# EAGLE design BEP2_rev1_RPM_mono (EAGLE 6.4)
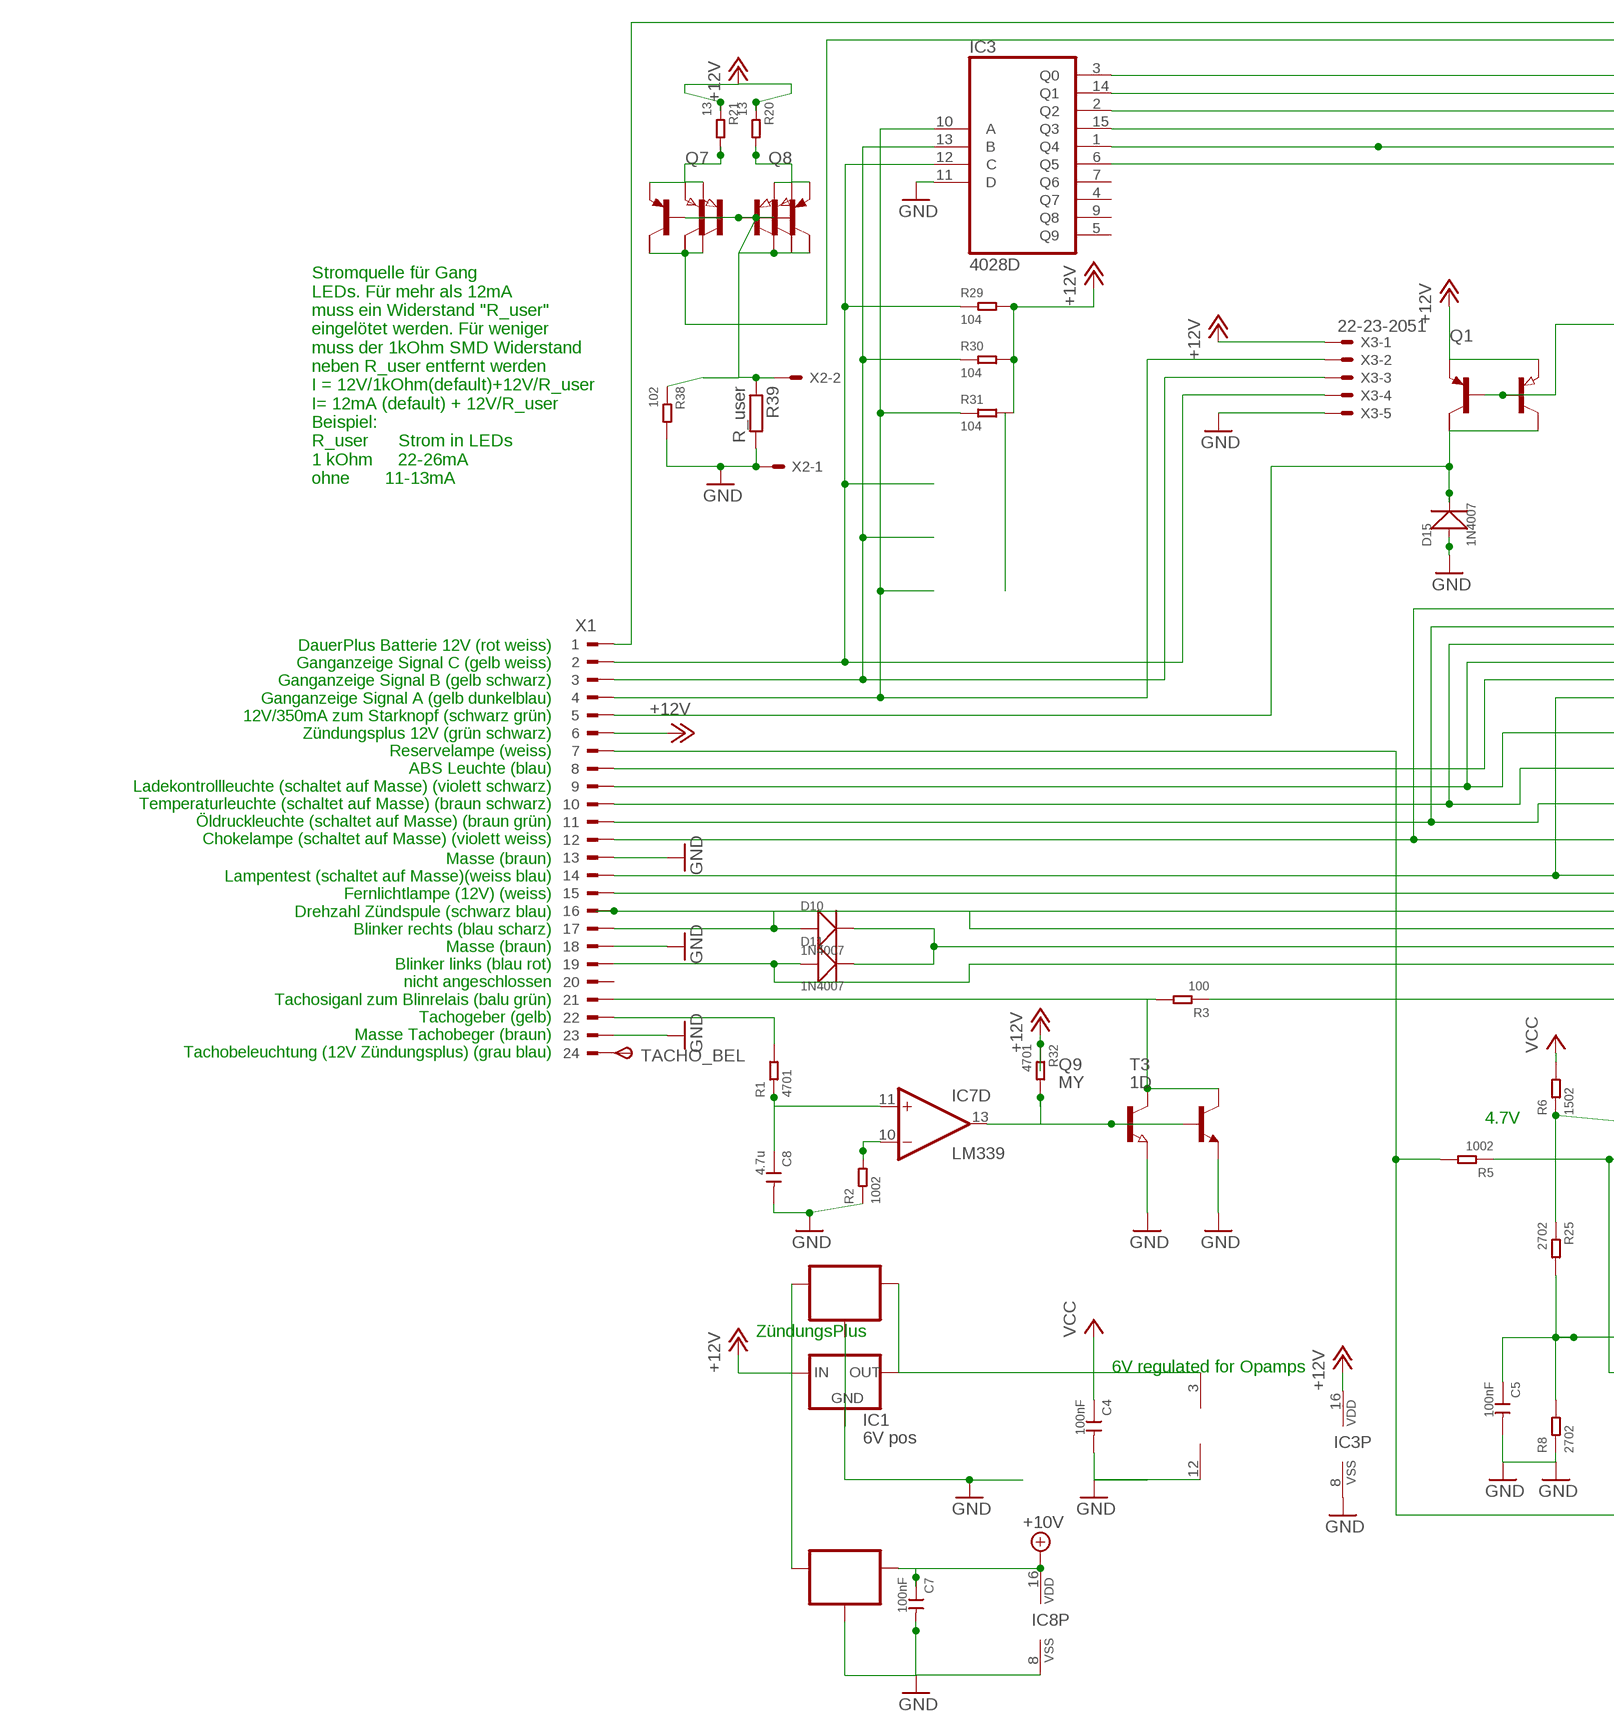
[diagram p0: schematic, sheet 1, part 1 of 2]
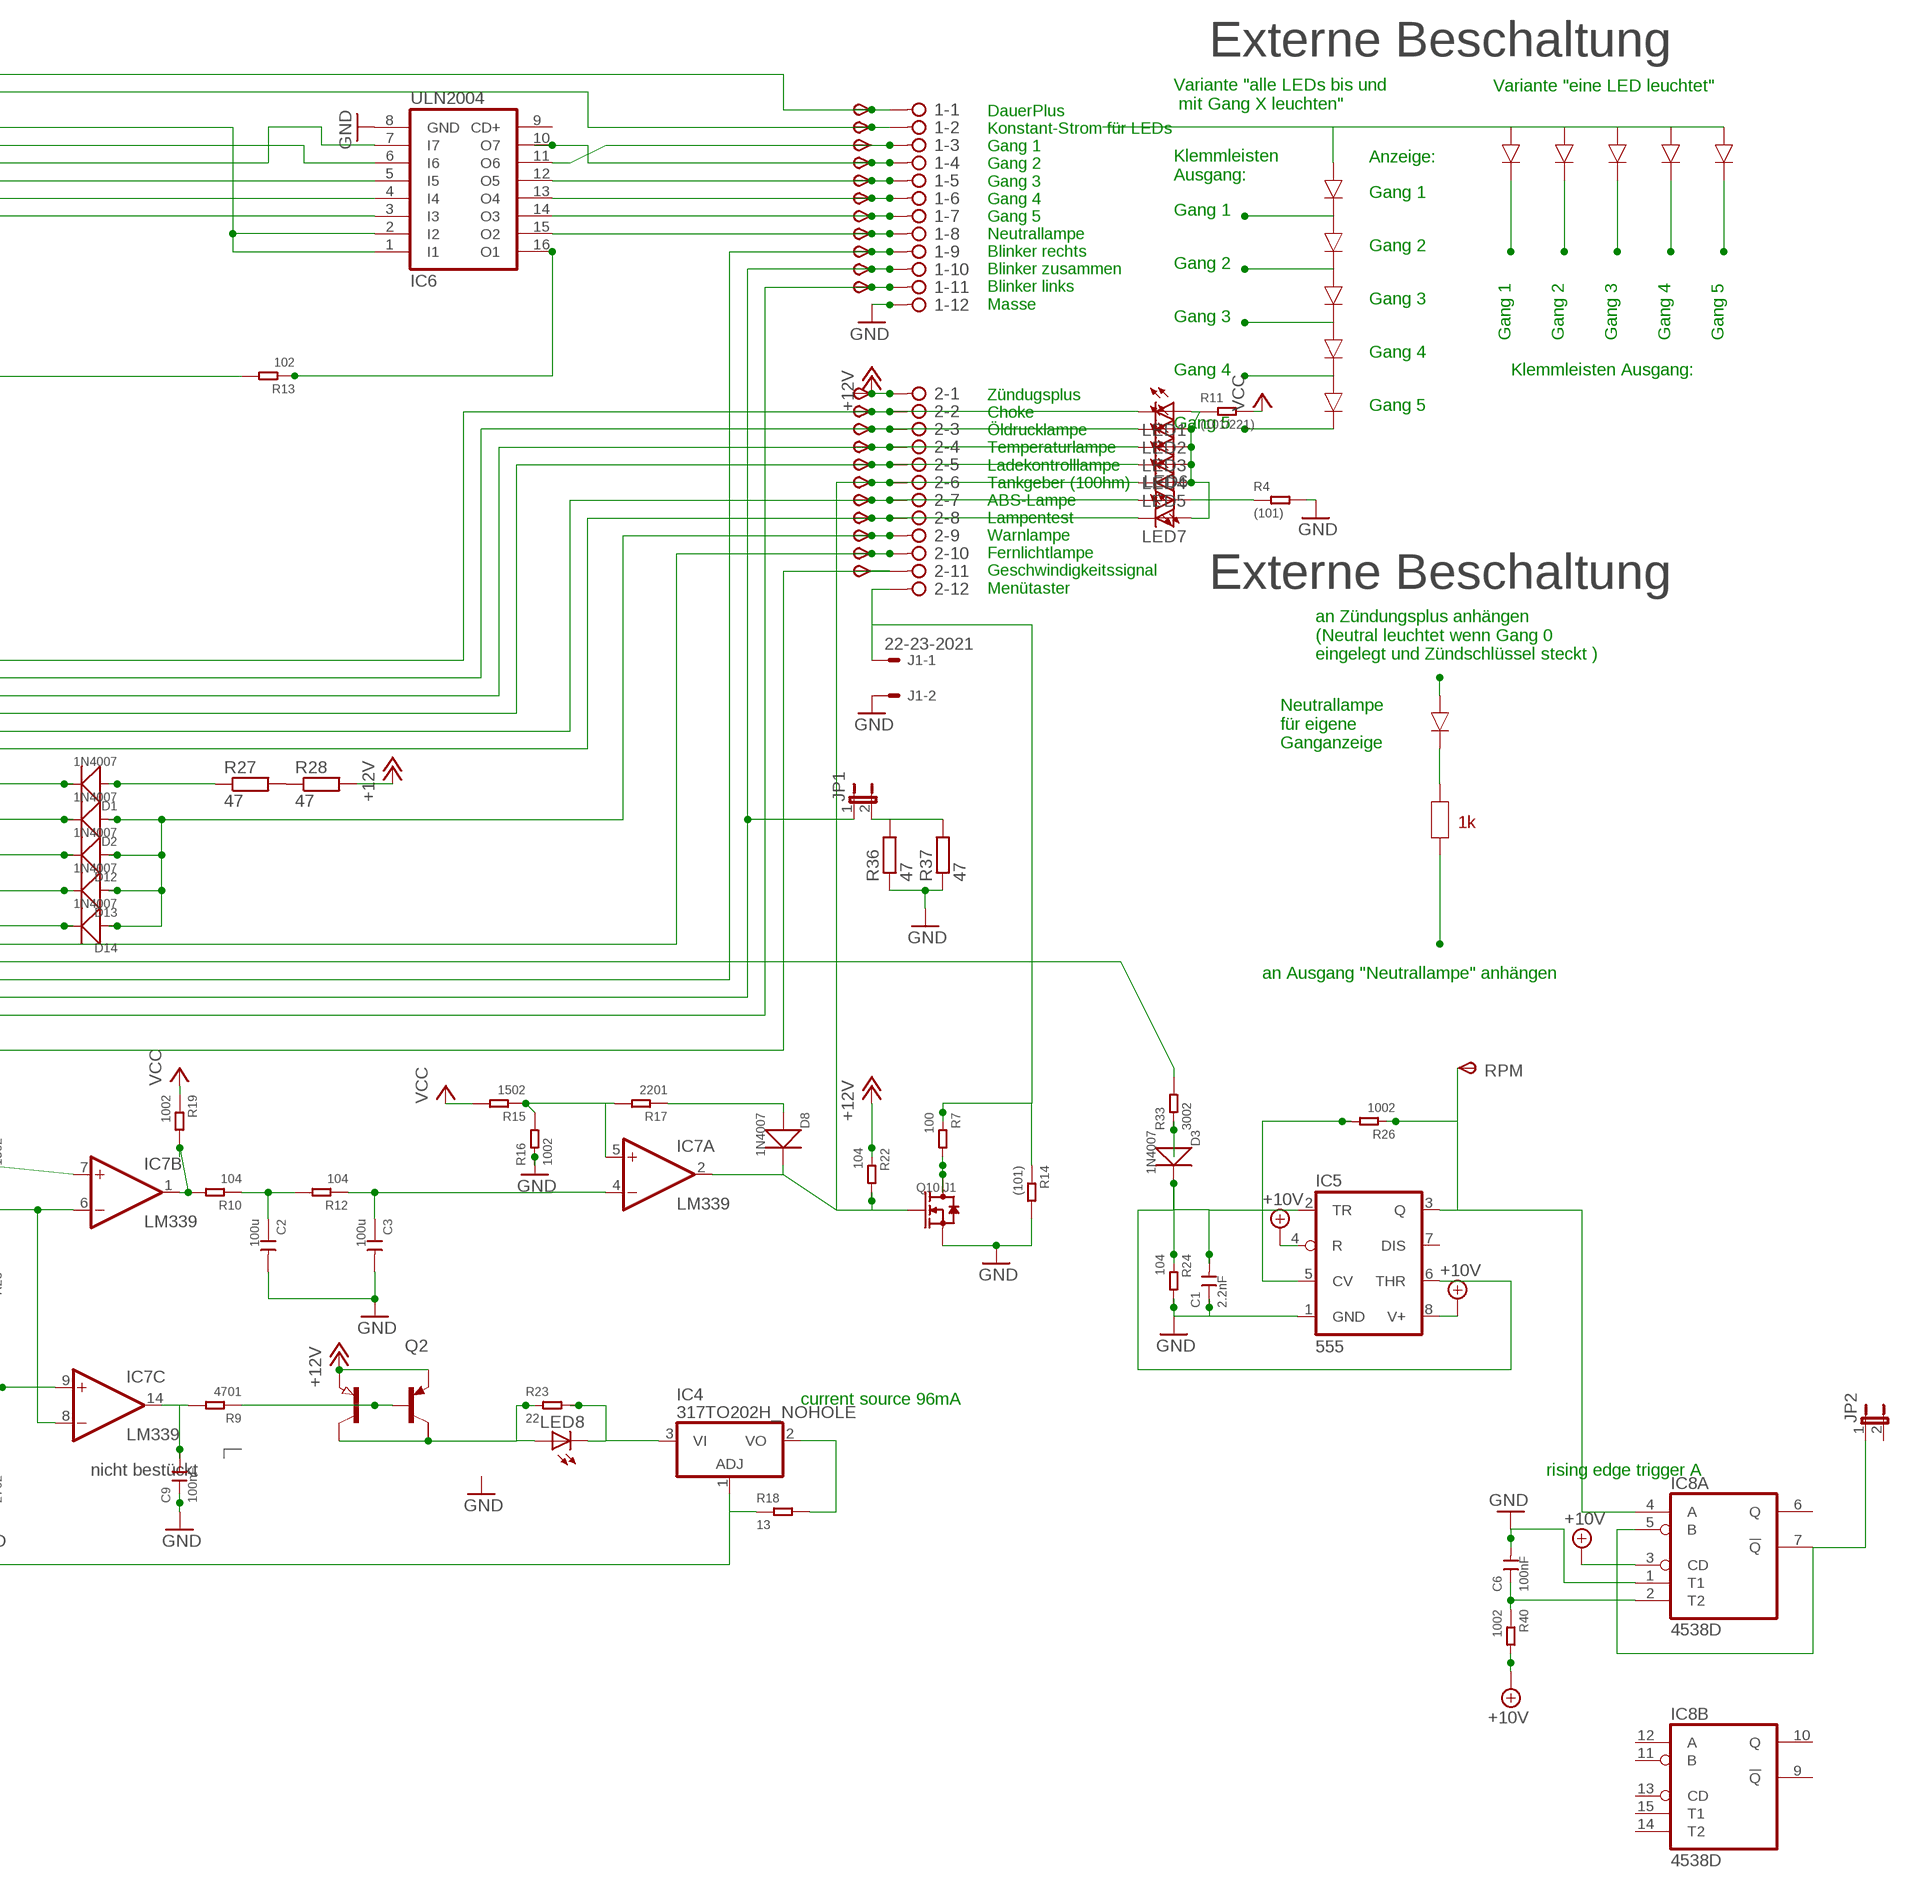
[diagram p1: schematic, sheet 1, part 2 of 2]

## Parts
1  2081-1132  [12-PIN]
2  2081-1132  [12-PIN]
C1  2.2nF  CERAMIC-100NF-50V-10%-X7R(0805)  [C0805]
C2  100u  CERAMIC-100UF-6.3V-20%-X5R(1206)  [C1206]
C3  100u  CERAMIC-100UF-6.3V-20%-X5R(1206)  [C1206]
C4  100nF  CERAMIC-100NF-50V-10%-X7R(0805)  [C0805]
C5  100nF  CERAMIC-100NF-50V-10%-X7R(0805)  [C0805]
C6  100nF  CERAMIC-100NF-50V-10%-X7R(0805)  [C0805]
C7  100nF  CERAMIC-100NF-50V-10%-X7R(0805)  [C0805]
C8  4.7u  CERAMIC-4.7UF-25V-10%-X5R(0805)  [C0805]
C9  100nF  CERAMIC-100NF-50V-10%-X7R(0805)  [C0805]
D1  1N4007  DIODE-GEN-PURPOSE-1KV-1A(DO-214AC)  [DO-214AC]
D2  1N4007  DIODE-GEN-PURPOSE-1KV-1A(DO-214AC)  [DO-214AC]
D3  1N4007  DIODE-GEN-PURPOSE-1KV-1A(DO-214AC)  [DO-214AC]
D8  1N4007  DIODE-GEN-PURPOSE-1KV-1A(DO-214AC)  [DO-214AC]
D10  1N4007  DIODE-GEN-PURPOSE-1KV-1A(DO-214AC)  [DO-214AC]
D11  1N4007  DIODE-GEN-PURPOSE-1KV-1A(DO-214AC)  [DO-214AC]
D12  1N4007  DIODE-GEN-PURPOSE-1KV-1A(DO-214AC)  [DO-214AC]
D13  1N4007  DIODE-GEN-PURPOSE-1KV-1A(DO-214AC)  [DO-214AC]
D14  1N4007  DIODE-GEN-PURPOSE-1KV-1A(DO-214AC)  [DO-214AC]
D15  1N4007  DIODE-GEN-PURPOSE-1KV-1A(DO-214AC)  [DO-214AC]
IC1  6V pos  78LXX  [78LXX]
IC2  78LXX-SOT89  [SOT89]
IC3  4028D  [SO16]
IC4  317TO202H_NOHOLE  [TO220H_NOHOLE]
IC5  555  NE555D  [SO08]
IC6  ULN2004  ULN2004AD  [SO16]
IC7  LM339  LM339D  [SO14]
IC8  4538D  [SO16]
IC9  78LXX-SOT89  [SOT89]
J1  22-23-2021  [22-23-2021]
JP1  JP1E  [JP1]
JP2  JP1E  [JP1]
LED1  LEDLD260  [LD260]
LED2  LEDLD260  [LD260]
LED3  LEDLD260  [LD260]
LED4  LEDLD260  [LD260]
LED5  LEDLD260  [LD260]
LED6  LEDLD260  [LD260]
LED7  LEDLD260  [LD260]
LED8  LEDLD260  [LD260]
Q1  PNP-TRANSISTOR_SOT89  [SOT89]
Q2  PNP-TRANSISTOR_SOT89  [SOT89]
Q3  AH-16  BCP53T1  [SOT223]
Q4  AH-16  BCP53T1  [SOT223]
Q5  (AH-16)  BCP53T1  [SOT223]
Q6  (AH-16)  BCP53T1  [SOT223]
Q7  PNP-TRANSISTOR_SOT89  [SOT89]
Q8  PNP-TRANSISTOR_SOT89  [SOT89]
Q9  MY  NPN-TRANSISTOR_SOT89  [SOT89]
Q10  J1  SMD-MOSFET-N-CH-50V-200MA-BSS138W-7-F(SOT-23)  [SOT-23]
R1  4701  SMD-RES-4.7K-5%-1/8W(0805)  [R0805]
R2  1002  SMD-RES-10K-1%-1/8W(0805)  [R0805]
R3  100  SMD-RES-220R-5%-1/8W(0805)  [R0805]
R4  (101)  SMD-RES-100R-5%-1/8W(0805)  [R0805]
R5  1002  SMD-RES-10K-1%-1/8W(0805)  [R0805]
R6  1502  SMD-RES-10K-1%-1/8W(0805)  [R0805]
R7  100  SMD-RES-2.2K-5%-1/8W(0805)  [R0805]
R8  2702  SMD-RES-4.7K-5%-1/8W(0805)  [R0805]
R9  4701  SMD-RES-4.7K-5%-1/8W(0805)  [R0805]
R10  104  SMD-RES-10K-1%-1/8W(0805)  [R0805]
R11  (101/221)  SMD-RES-100R-5%-1/8W(0805)  [R0805]
R12  104  SMD-RES-10K-1%-1/8W(0805)  [R0805]
R13  102  SMD-RES-1K-5%-1/8W(0805)  [R0805]
R14  (101)  SMD-RES-2.2K-5%-1/8W(0805)  [R0805]
R15  1502  SMD-RES-10K-1%-1/8W(0805)  [R0805]
R16  1002  SMD-RES-10K-1%-1/8W(0805)  [R0805]
R17  2201  SMD-RES-2.2K-5%-1/8W(0805)  [R0805]
R18  13  SMD-RES-13R-5%-1/4W(1206)  [R1206]
R19  1002  SMD-RES-10K-1%-1/8W(0805)  [R0805]
R20  13  SMD-RES-13R-5%-1/4W(1206)  [R1206]
R21  13  SMD-RES-13R-5%-1/4W(1206)  [R1206]
R22  104  SMD-RES-10K-1%-1/8W(0805)  [R0805]
R23  22  SMD-RES-13R-5%-1/4W(1206)  [R1206]
R24  104  SMD-RES-10K-1%-1/8W(0805)  [R0805]
R25  2702  SMD-RES-4.7K-5%-1/8W(0805)  [R0805]
R26  1002  SMD-RES-10K-1%-1/8W(0805)  [R0805]
R27  47  R-EU_V235/17_1MM  [V235/17_1MM]
R28  47  R-EU_V235/17_1MM  [V235/17_1MM]
R29  104  SMD-RES-10K-1%-1/8W(0805)  [R0805]
R30  104  SMD-RES-10K-1%-1/8W(0805)  [R0805]
R31  104  SMD-RES-10K-1%-1/8W(0805)  [R0805]
R32  4701  SMD-RES-4.7K-5%-1/8W(0805)  [R0805]
R33  3002  SMD-RES-10K-1%-1/8W(0805)  [R0805]
R36  47  R-EU_V235/17_1MM  [V235/17_1MM]
R37  47  R-EU_V235/17_1MM  [V235/17_1MM]
R38  102  SMD-RES-1K-5%-1/8W(0805)  [R0805]
R39  R_user  R-EU_R0805  [R0805]
R40  1002  SMD-RES-4.7K-5%-1/8W(0805)  [R0805]
RPM  TPSP1_1MM  [P1_1.0MM]
T1  PNP2SM8  [SM8]
T3  1D  MMBTA42LT1-NPN-SOT23-BEC  [SOT23-BEC]
TACHO_BEL  TPSP1_1MM  [P1_1.0MM]
TP1  TPSB1.8  [B1.8]
TP2  TPSB1.8  [B1.8]
TP3  TPSB1.8  [B1.8]
TP4  TPSB1.8  [B1.8]
TP5  TPSB1.8  [B1.8]
TP6  TPSB1.8  [B1.8]
TP7  TPSB1.8  [B1.8]
TP8  TPSB1.8  [B1.8]
TP9  TPSB1.8  [B1.8]
TP10  TPSB1.8  [B1.8]
TP11  TPSB1.8  [B1.8]
TP12  TPSB1.8  [B1.8]
TP16  TPSB1.8  [B1.8]
TP17  TPSB1.8  [B1.8]
TP18  TPSB1.8  [B1.8]
TP19  TPSB1.8  [B1.8]
TP21  TPSB1.8  [B1.8]
TP22  TPSB1.8  [B1.8]
TP23  TPSB1.8  [B1.8]
TP24  TPSB1,27  [B1,27]
TP25  TPSB1.8  [B1.8]
TP26  TPSB1.8  [B1.8]
X1  CON_BMWV2  [24-PIN_V2]
X2  22-23-2021  [22-23-2021]
X3  22-23-2051  [22-23-2051]

## Nets
+10V: C7.1 IC5.4(R) IC5.8(V+) IC8.3(A:CD) IC8.16(P:VDD) IC9.1(OUT) R40.2
+12V: 2.1 IC1.IN IC2.3(IN) IC3.16(VDD) IC9.3(IN) Q1.3(E) Q2.3(E) Q3.3(E) Q4.3(E) R20.1 R21.1 R22.1 R28.2 R29.2 R30.2 R31.2 R32.1 TP12.TP(PP) X1.6 X3.1
GND: 1.12 C1.1 C2.2 C3.2 C4.2 C5.2 C6.2 C7.2 C8.2 C9.1 D15.1(+) IC1.GND IC2.2(GND) IC2.4(GND) IC3.8(VSS) IC3.11(D) IC5.1(GND) IC6.8(GND) IC7.12(P:GND) IC8.1(A:T1) IC8.8(P:VSS) J1.2 Q9.3(E) Q10.2(S) R2.1 R4.2 R8.1 R14.2 R16.1 R24.2 R36.1 R37.1 R38.2 R39.2 T3.E X1.13 X1.18 X1.23 X2.1 X3.5
N$1: 2.9 D2.1(+) D12.1(+) D13.1(+) D14.1(+) TP24.TP(PP)
N$2: IC3.10(A) R31.1 X1.4 X3.2
N$3: IC3.13(B) R30.1 X1.3 X3.3
N$4: 2.7 LED6.A TP22.TP(PP) X1.8
N$5: Q5.3(E) Q8.3(E) R21.2 T1.1(B:E)
N$6: IC6.16(O1) R13.1
N$7: IC7.10(D:-IN) R2.2
N$8: R27.2 R28.1
N$9: Q6.3(E) Q7.3(E) R20.2 T1.3(A:E)
N$11: D15.2(-) Q1.2(C) Q3.2(C) X1.5
N$12: 2.2 D13.2(-) LED1.K(C) TP16.TP(PP) X1.12
N$13: 2.3 D12.2(-) LED2.K(C) TP17.TP(PP) X1.11
N$14: 2.4 D2.2(-) LED3.K(C) TP18.TP(PP) X1.10
N$15: IC4.3(VI) LED8.K(C) R23.2
N$16: IC7.6(B:-IN) IC7.8(C:-IN) R5.1
N$17: IC3.12(C) R29.1 X1.2 X3.4
N$18: IC3.15(Q3) IC6.5(I5)
N$19: 2.8 D14.2(-) LED7.K(C) TP23.TP(PP) X1.14
N$20: 1.9 D10.1(+) TP9.TP(PP) X1.17
N$21: 1.11 D11.1(+) TP11.TP(PP) X1.19
N$23: R1.2 X1.22
N$24: C8.1 IC7.11(D:+IN) R1.1
N$25: 1.6 IC6.13(O4) TP6.TP(PP)
N$26: 1.7 IC6.14(O3) TP7.TP(PP)
N$27: 2.11 R3.1 TP26.TP(PP)
N$28: 2.12 J1.1 R7.1 R14.1
N$29: LED8.A Q2.2(C) Q4.2(C) R23.1
N$30: C5.1 IC7.9(C:+IN) R8.2 R25.2
N$31: C9.2 IC7.14(C:OUT) R9.2
N$32: C1.2 D3.2(-) IC5.2(TR) IC5.6(THR) R24.1
N$34: LED6.K(C) R4.1
N$35: IC4.1(ADJ) R5.2 R18.1 X1.7
N$36: Q2.1(B) Q4.1(B) R9.1
N$37: IC3.2(Q2) IC6.7(I7)
N$38: 1.3 IC6.11(O6) TP3.TP(PP)
N$39: 1.5 IC6.12(O5) TP5.TP(PP)
N$41: LED1.A LED2.A LED3.A LED4.A LED5.A LED7.A R11.1
N$42: R33.2 X1.16
N$43: Q1.1(B) Q3.1(B) R13.2
N$44: IC3.3(Q0) IC6.1(I1) IC6.2(I2)
N$45: C2.1 R10.1 R12.2
N$46: C3.1 IC7.4(A:-IN) R12.1
N$47: IC7.5(A:+IN) R15.1 R16.2 R17.2
N$48: Q10.3(D) R7.2
N$49: D8.1(+) R17.1
N$50: IC3.1(Q4) IC6.4(I4)
N$52: 1.8 IC6.15(O2) TP8.TP(PP)
N$53: 2.10 TP25.TP(PP) X1.15
N$54: D1.1(+) R27.1
N$55: 2.5 D1.2(-) LED4.K(C) TP19.TP(PP) X1.9
N$56: IC3.14(Q1) IC6.6(I6)
N$57: Q5.1(B) Q6.1(B) Q6.2(C) Q7.1(B) Q7.2(C) Q8.1(B) R38.1 R39.1 T1.2(B:B) T1.4(A:B) T1.6(A:C1) X2.2
N$58: TACHO_BEL.TP(PP) X1.24
N$59: 1.2 Q5.2(C) Q8.2(C) T1.8(B:C1) TP2.TP(PP)
N$60: 2.6 D8.2(-) IC7.2(A:OUT) LED5.K(C) Q10.1(G) R22.2 TP21.TP(PP)
N$61: IC3.6(Q5) IC6.3(I3)
N$64: IC4.2(VO) R18.2
N$65: IC5.5(CV) R26.2
N$67: 1.4 IC6.10(O7) TP4.TP(PP)
N$69: 1.1 TP1.TP(PP) X1.1
N$83: IC7.7(B:+IN) R6.1 R25.1
N$84: Q9.2(C) R3.2 T3.C X1.21
N$85: IC7.13(D:OUT) Q9.1(B) R32.2 T3.B
N$86: IC5.3(Q) IC8.4(A:A) R26.1 RPM.TP(PP)
N$87: D3.1(+) R33.1
N$90: IC8.5(A:B) IC8.7(A:!Q) JP2.1
N$92: C6.1 IC8.2(A:T2) R40.1
N$93: 1.10 D10.2(-) D11.2(-) JP1.1 TP10.TP(PP)
N$94: JP1.2 R36.2 R37.2
N$580: IC7.1(B:OUT) R10.2 R19.2
VCC: C4.1 IC1.OUT IC2.1(OUT) IC7.3(P:V+) R6.2 R11.2 R15.2 R19.1
Unconnected: IC3.4(Q7) IC3.5(Q9) IC3.7(Q6) IC3.9(Q8) IC5.7(DIS) IC6.9(CD+) IC8.6(A:Q) IC8.9(B:!Q) IC8.10(B:Q) IC8.11(B:B) IC8.12(B:A) IC8.13(B:CD) IC8.14(B:T2) IC8.15(B:T1) IC9.2(GND) IC9.4(GND) JP2.2 Q3.4(C/) Q4.4(C/) Q5.4(C/) Q6.4(C/) T1.5(A:C) T1.7(B:C) X1.20

## Notes on the sheet
- Externe Beschaltung
- Variante "eine LED leuchtet"
- Variante "alle LEDs bis und
   mit Gang X leuchten"
- Anzeige:
- Klemmleisten
  Ausgang:
- Gang 1
- DauerPlus
  Konstant-Strom für LEDs
  Gang 1
  Gang 2
  Gang 3
  Gang 4
  Gang 5
  Neutrallampe
  Blinker rechts
  Blinker zusammen
  Blinker links
  Masse
- Gang 1
- Gang 2
- Gang 2
- Gang 3
- Gang 3
- Gang 1 | Gang 2 | Gang 3 | Gang 4 | Gang 5
- Gang 4
- Gang 4 | Klemmleisten Ausgang:
- Gang 5
- Gang 5
- Zündugsplus
  Choke
  Öldrucklampe
  Temperaturlampe
  Ladekontrolllampe
  Tankgeber (100hm)
  ABS-Lampe
  Lampentest
  Warnlampe
  Fernlichtlampe
  Geschwindigkeitssignal
  Menütaster
- Stromquelle für Gang
  LEDs. Für mehr als 12mA
  muss ein Widerstand "R_user"
  eingelötet werden. Für weniger
  muss der 1kOhm SMD Widerstand
  neben R_user entfernt werden
  I = 12V/1kOhm(default)+12V/R_user
  I= 12mA (default) + 12V/R_user
  Beispiel:
  R_user      Strom in LEDs
  1 kOhm     22-26mA
  ohne       11-13mA
- Externe Beschaltung
- an Zündungsplus anhängen
  (Neutral leuchtet wenn Gang 0
  eingelegt und Zündschlüssel steckt )
- Neutrallampe
  für eigene
  Ganganzeige
- DauerPlus Batterie 12V (rot weiss)
  Ganganzeige Signal C (gelb weiss)
  Ganganzeige Signal B (gelb schwarz)
  Ganganzeige Signal A (gelb dunkelblau)
  12V/350mA zum Starknopf (schwarz grün)
  Zündungsplus 12V (grün schwarz)
  Reservelampe (weiss)
  ABS Leuchte (blau)
  Ladekontrollleuchte (schaltet auf Masse) (violett schwarz)
  Temperaturleuchte (schaltet auf Masse) (braun schwarz)
  Öldruckleuchte (schaltet auf Masse) (braun grün)
  Chokelampe (schaltet auf Masse) (violett weiss)
- 1k
- an Ausgang "Neutrallampe" anhängen
- Masse (braun)
  Lampentest (schaltet auf Masse)(weiss blau)
  Fernlichtlampe (12V) (weiss)
  Drehzahl Zündspule (schwarz blau)
  Blinker rechts (blau scharz)
  Masse (braun)
  Blinker links (blau rot)
  nicht angeschlossen
  Tachosiganl zum Blinrelais (balu grün)
  Tachogeber (gelb)
  Masse Tachobeger (braun)
  Tachobeleuchtung (12V Zündungsplus) (grau blau)
- 4.7V
- ZündungsPlus
- current source 96mA
- 6V regulated for Opamps
- nicht bestückt | rising edge trigger A

## Library data of the parts
1 2 = con WAGO BMW:2081-1132: WAGO SREW CLAMP
C1 C4-C7 C9 = Seeed-Capacitor-2016:CERAMIC-100NF-50V-10%-X7R(0805): 302010165; MPN: CC0805KRX7R9BB104; VALUE: 100nf
C2 C3 = Seeed-Capacitor-2016:CERAMIC-100UF-6.3V-20%-X5R(1206): 302010183; MPN: GRM31CR60J107ME39L; VALUE: 100uf
C8 = Seeed-Capacitor-2016:CERAMIC-4.7UF-25V-10%-X5R(0805): 302010146; MPN: CC0805KKX5R8BB475; VALUE: 4.7uf
D1-D3 D10-D15 = Diode-do214ac:DIODE-GEN-PURPOSE-1KV-1A(DO-214AC): 304010013; MPN: 1N4007
D8 = Seeed-Diode-2016:DIODE-GEN-PURPOSE-1KV-1A(DO-214AC): 304010013; MPN: 1N4007
IC1 = v-reg:78LXX: VOLTAGE REGULATOR
IC2 IC9 = 78LXX:78LXX
IC3 = 4028:4028: BCD to decimal DECODER
IC4 = linear_BMW:*317: Positive VOLTAGE REGULATOR
IC5 = linear:*555: TIMER
IC6 = uln-udn:ULN2004A: DRIVER ARRAY
IC7 = LM339:LM339: Low Power Low Offset Voltage Quad Comparators with open collector; LM139/LM239/LM339/LM2901/LM3302
IC8 = 45xx:4538: Dual precision monostable MULTIVIBRATOR
J1 X2 = con_Molex_BMW:22-23-2021: .100" (2.54mm) Center Header - 2 Pin; MF: MOLEX; MPN: 22-23-2021; OC_FARNELL: 1462926; OC_NEWARK: 25C3832
JP1 JP2 = jumper:JP1E: JUMPER
LED1-LED8 = led:LED: LED OSRAM: - CHIPLED LG R971, LG N971, LY N971, LG Q971, LY Q971, LO R971, LY R971 LH N974, LH R974 LS Q976, LO Q976, LY Q976 LO Q996 - Hyper CHIPLED LW Q18S LB Q993, LB Q99A, LB R99A - SideLED LS A670, LO A670, LY A670, LG A670, LP A670 LB A673, LV A673, LT A673, LW A673 LH A674 LY A675 LS A676, LA A676, LO A676, LY A676, LW A676 LS A679, LY A679, LG A679 - Hyper Micro SIDELED® LS Y876, LA Y876, LO Y876, LY Y876 LT Y87S - SmartLED LW L88C, LW L88S LB L89C, LB L89S, LG L890 LS L89K, LO L89K, LY L89K LS L896, LA L896, LO L896, LY L896 - TOPLED LS T670, LO T670, LY T670, LG T670, LP T670 LSG T670, LSP T670, LSY T670, LOP T670, LYG T670 LG T671, LOG T671, LSG T671 LB T673, LV T673, LT T673, LW T673 LH T674 LS T676, LA T676, LO T676, LY T676, LB T676, LH T676, LSB T676, LW T676 LB T67C, LV T67C, LT T67C, LS T67K, LO T67K, LY T67K, LW E67C LS E67B, LA E67B, LO E67B, LY E67B, LB E67C, LV E67C, LT E67C LW T67C LS T679, LY T679, LG T679 LS T770, LO T770, LY T770, LG T770, LP T770 LB T773, LV T773, LT T773, LW T773 LH T774 LS E675, LA E675, LY E675, LS T675 LS T776, LA T776, LO T776, LY T776, LB T776 LHGB T686 LT T68C, LB T68C - Hyper Mini TOPLED® LB M676 - Mini TOPLED Santana® LG M470 LS M47K, LO M47K, LY M47K Source: http://www.osram.convergy.de LUXEON: - LUMILED® LXK2-PW12-R00, LXK2-PW12-S00, LXK2-PW14-U00, LXK2-PW14-V00 LXK2-PM12-R00, LXK2-PM12-S00, LXK2-PM14-U00 LXK2-PE12-Q00, LXK2-PE12-R00, LXK2-PE12-S00, LXK2-PE14-T00, LXK2-PE14-U00 LXK2-PB12-K00, LXK2-PB12-L00, LXK2-PB12-M00, LXK2-PB14-N00, LXK2-PB14-P00, LXK2-PB14-Q00 LXK2-PR12-L00, LXK2-PR12-M00, LXK2-PR14-Q00, LXK2-PR14-R00 LXK2-PD12-Q00, LXK2-PD12-R00, LXK2-PD12-S00 LXK2-PH12-R00, LXK2-PH12-S00 LXK2-PL12-P00, LXK2-PL12-Q00, LXK2-PL12-R00 Source: www.luxeon.com KINGBRIGHT: KA-3528ASYC Source: www.kingbright.com
Q1 Q2 Q7 Q8 = Transistor_SOT89:PNP-TRANSISTOR_: PNP TRANSISTOR
Q3-Q6 = BCP53_:BCP53*
Q9 = Transistor_SOT89:NPN-TRANSISTOR_: NPN TRANSISTOR
Q10 = Seeed-Transistor-2016:SMD-MOSFET-N-CH-50V-200MA-BSS138W-7-F(SOT-23): 305030000; MPN: BSS138W-7-F; VALUE: BSS138W-7-F
R1 R8 R9 R25 R32 R40 = Seeed-Resistor-2016:SMD-RES-4.7K-5%-1/8W(0805): 301010306; MPN: RC0805JR-074K7L; VALUE: 4.7K
R2 R5 R6 R10 R12 R15 R16 R19 R22 R24 R26 R29-R31 R33 = Seeed-Resistor-2016:SMD-RES-10K-1%-1/8W(0805): 301010361; MPN: RC0805FR-0710KL; VALUE: 10K
R3 = Seeed-Resistor-2016:SMD-RES-220R-5%-1/8W(0805): 301010315; MPN: RC0805JR-07220RL; VALUE: 220R
R4 R11 = Seeed-Resistor-2016:SMD-RES-100R-5%-1/8W(0805): 301010319; MPN: RC0805JR-07100RL; VALUE: 100R
R7 R14 R17 = Seeed-Resistor-2016:SMD-RES-2.2K-5%-1/8W(0805): 301010333; MPN: RC0805JR-072K2L; VALUE: 2.2K
R13 R38 = Seeed-Resistor-2016:SMD-RES-1K-5%-1/8W(0805): 301010311; MPN: RC0805JR-071KL; VALUE: 1K
R18 R20 R21 R23 = Seeed-Resistor-2016:SMD-RES-13R-5%-1/4W(1206): 301010405; MPN: RC1206JR-0713RL; VALUE: 13R
R27 R28 R36 R37 R39 = rcl:R-EU_: RESISTOR, European symbol
RPM TACHO_BEL TP1-TP12 TP16-TP19 TP21-TP26 = testpin_BMW:TPS: TEST PIN
T1 = PNP2SM8:PNP2SM8; OC_FARNELL: unknown; OC_NEWARK: unknown
T3 = transistor:*-NPN-: NPN Transistror BF959 corrected 2008.03.06
X1 = con_BMW:CON_BMW: BMW CONNECTOR
X3 = con_Molex_BMW:22-23-2051: .100" (2.54mm) Center Header - 5 Pin; MF: MOLEX; MPN: 22-23-2051; OC_FARNELL: 1462952; OC_NEWARK: 38C9178

## Board
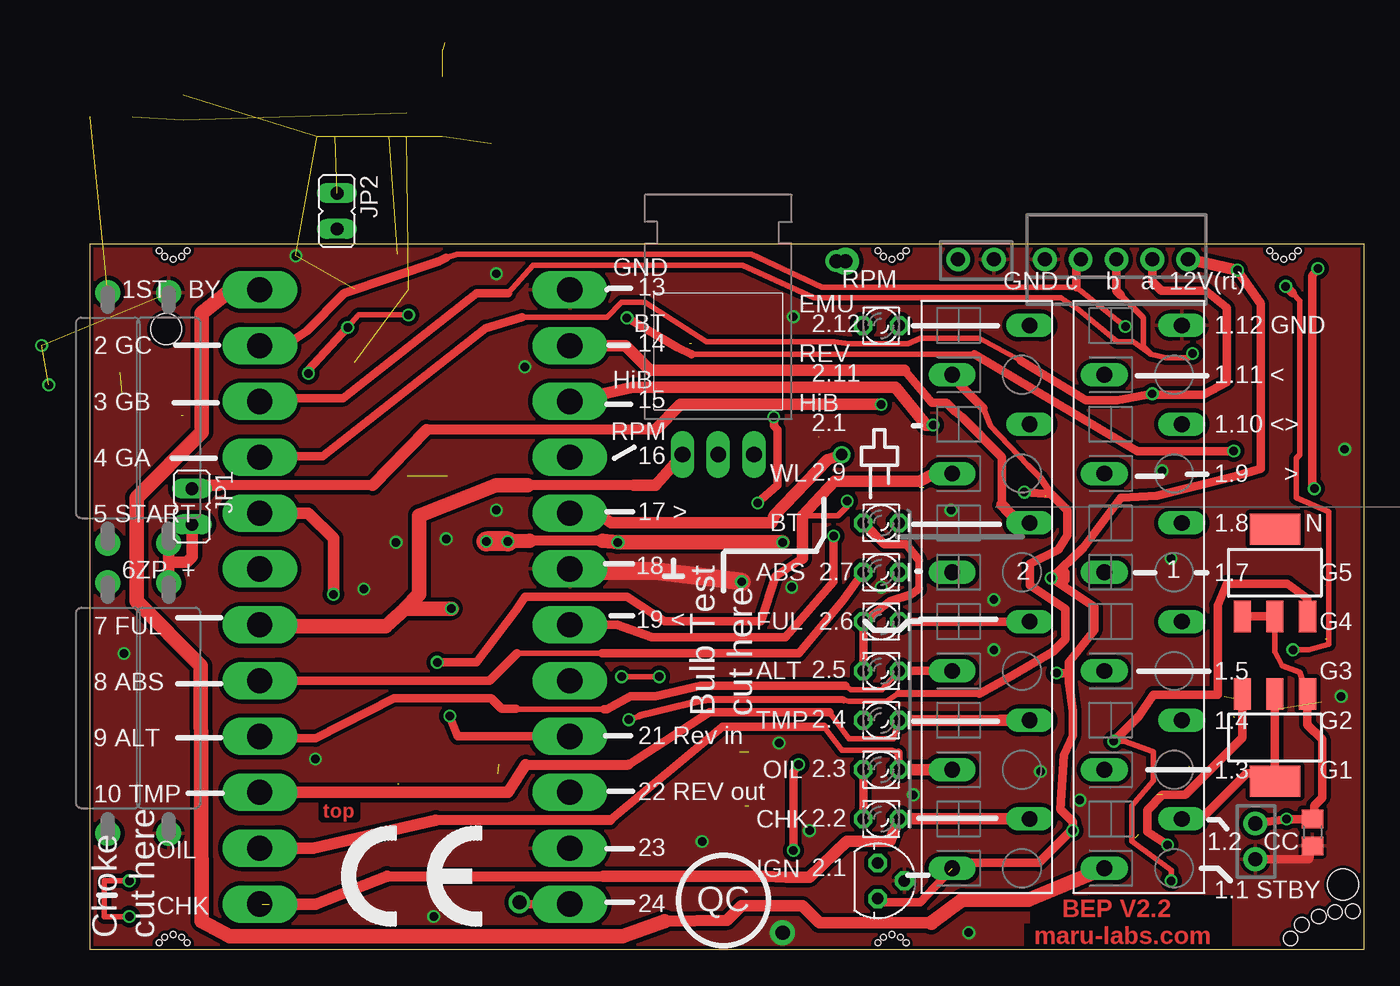
[diagram p2: board, top side]
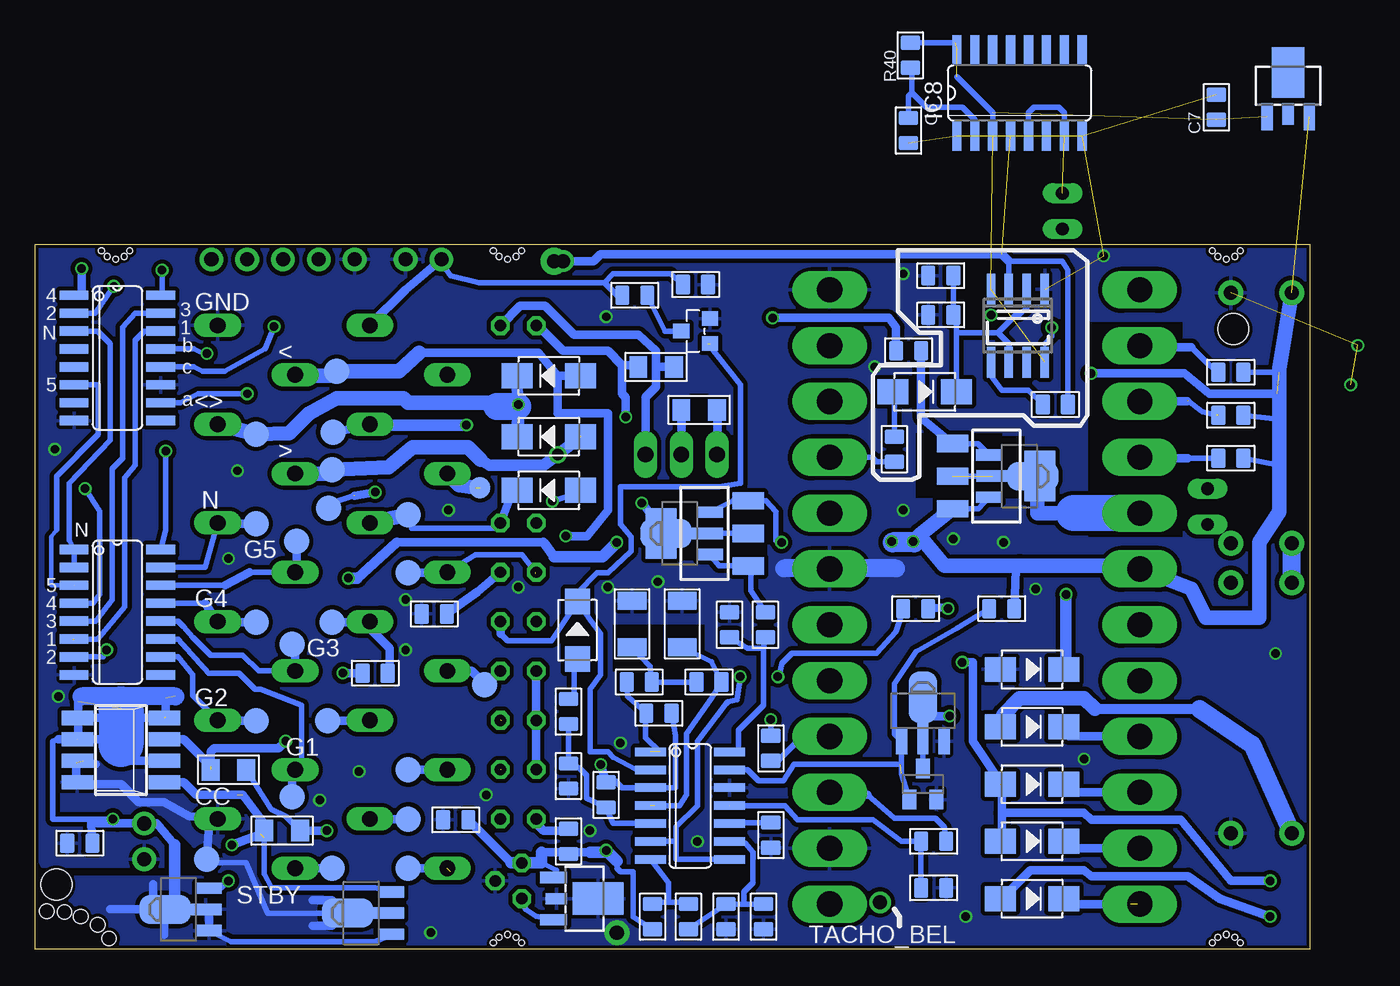
[diagram p3: board, bottom side, seen from below]

Size 90.41 x 50 mm. Coordinates in mm from the lower left corner, seen from the top.
Outline: 0,0 90.41,0 90.41,50 0,50 0,0
Copper layers (1*16): Top 0.035mm / dielectric 1.5mm / Bottom 0.035mm
Design rules "SeeedStudio_2layer_DRU_no_angle_20140221 *": minimum track width 6mil, minimum drill 12mil, track to track 12mil, track to pad 12mil, pad to pad 6mil, via to via 6mil, smd to smd 0mil, copper to edge 10mil, drill to drill 10mil, minimum pad ring 10mil, minimum via ring 6mil, stop-mask expansion 2mil, vias tented up to drill 100mil, thermal gap 10mil
Holes 1.02 mm at 89.6,2.71 88.33,2.64 87.19,2.33 85.98,1.75 85.17,0.77
Holes 2.18 mm at 88.91,4.6 5.41,44
Holes 0.4 mm at 56.91,1.06 56.31,0.86 55.91,0.46 57.51,0.86 57.91,0.46 5.91,1.06 5.31,0.86 4.91,0.46 6.51,0.86 6.91,0.46 5.91,48.94 6.51,49.14 6.91,49.54 5.31,49.14 4.91,49.54 56.91,48.94 57.51,49.14 57.91,49.54 56.31,49.14 55.91,49.54 84.71,48.94 85.31,49.14 85.71,49.54 84.11,49.14 83.71,49.54
tRestrict: area 70.8,0.3 to 81,3.8; area 66.3,0.3 to 70.9,1.8
bRestrict: area 9,29.3 to 15.7,44.5; area 38.5,27.9 to 41.3,29; area 43.6,27.6 to 44.8,29.1; area 20.2,32 to 24.4,36.4; area 45,28.7 to 45.7,30.4; area 21.8,32 to 27.9,36.6; area 42.7,37.4 to 43.9,39.4; area 42.9,19.7 to 49.4,23; area 27.1,10.2 to 27.7,11.1

### Footprints (pad centres in the part's own frame; a part is rotated, then mirrored left to right if it is on the bottom)
12-PIN = drill 1.118 long: 1 19.25,-2.45; 2 15.75,3.05; 3 12.25,-2.45; 4 8.75,3.05; 5 5.25,-2.45; 6 1.75,3.05; 7 -1.75,-2.45; 8 -5.25,3.05; 9 -8.75,-2.45; 10 -12.25,3.05; 11 -15.75,-2.45; 12 -19.25,3.05
C0805 = smd 1.397 x 1.016: 1 0,0.889; 2 0,-0.889
C1206 = smd 1.27 x 2.032: 1 -1.651,0; 2 1.651,0
DO-214AC = smd 2.2 x 1.77: 1 -2.242,0; 2 2.242,0
DO-214AC' = smd 1.8 x 1.77: 1 -2.042,0; 2 2.042,0
78LXX = drill 0.813 octagon: GND 0,1.905; IN 1.27,0; OUT -1.27,0
SOT89 = smd 0.8 x 1.9: 1 -1.5,-1.95; 3 1.5,-1.95 | smd 0.8 x 1.5: 2 0,-1.75 | smd 2.3 x 3.6: 4 0,1.2
SO16 = smd 0.66 x 2.032: 1 -4.445,-3.073; 2 -3.175,-3.073; 3 -1.905,-3.073; 4 -0.635,-3.073; 5 0.635,-3.073; 6 1.905,-3.073; 7 3.175,-3.073; 8 4.445,-3.073; 9 4.445,3.073; 10 3.175,3.073; 11 1.905,3.073; 12 0.635,3.073; 13 -0.635,3.073; 14 -1.905,3.073; 15 -3.175,3.073; 16 -4.445,3.073
TO220H_NOHOLE = drill 1.118 long: 1 -2.54,-10.16; 2 0,-10.16; 3 2.54,-10.16
SO08 = smd 0.6 x 2.2: 1 -1.905,-2.6; 2 -0.635,-2.6; 3 0.635,-2.6; 4 1.905,-2.6; 5 1.905,2.6; 6 0.635,2.6; 7 -0.635,2.6; 8 -1.905,2.6
SO14 = smd 0.6 x 2.2: 1 -3.81,-2.8; 2 -2.54,-2.8; 3 -1.27,-2.8; 4 0,-2.8; 5 1.27,-2.8; 6 2.54,-2.8; 7 3.81,-2.8; 8 3.81,2.8; 9 2.54,2.8; 10 1.27,2.8; 11 0,2.8; 12 -1.27,2.8; 13 -2.54,2.8; 14 -3.81,2.8
22-23-2021 = drill 1 pad 1.676: 1 -1.27,0; 2 1.27,0
JP1 = drill 0.914 long: 1 0,-1.27; 2 0,1.27
LD260 = drill 0.813 octagon: A -1.27,0; K 1.27,0
SOT89' = smd 0.8 x 1.8: 1 -1.499,-2.181; 3 1.499,-2.181 | smd 0.8 x 2.3: 2 0,-1.927 | smd 2.032 x 3.65: 2@1 0,0.94
SOT223 = smd 1.219 x 2.235: 1 -2.311,-3.099; 2 0,-3.099; 3 2.311,-3.099 | smd 3.6 x 2.2: 4 0,3.099
SOT-23 = smd 1.016 x 1.143: 1 -0.889,-1.016; 2 0.889,-1.016; 3 0,1.016
R0805 = smd 1.397 x 1.016: 1 0,0.889; 2 0,-0.889
R1206 = smd 1.27 x 1.524: 1 -1.27,0; 2 1.27,0
V235/17_1MM = drill 1 pad 1.778: 1 -8.89,0; 2 8.89,0
R0805' = smd 1.3 x 1.5: 1 -0.95,0; 2 0.95,0
P1_1.0MM = drill 1.016: TP 0,0
SM8 = smd 1.016 x 2.235: 1 -2.286,-3.099; 2 -0.762,-3.099; 3 0.762,-3.099; 4 2.286,-3.099; 5 2.286,3.099; 6 0.762,3.099; 7 -0.762,3.099; 8 -2.286,3.099
SOT23-BEC = smd 1 x 1.4: B -0.95,-1.1; C 0,1.1; E 0.95,-1.1
B1.8 = smd 1.8 x 1.8: TP 0,0
B1,27 = smd 1.5 x 1.5: TP 0,0
24-PIN_V2 = drill 1.778 long: 1 -21.78,-11; 2 -17.82,-11; 3 -13.86,-11; 4 -9.9,-11; 5 -5.94,-11; 6 -1.98,-11; 7 1.98,-11; 8 5.94,-11; 9 9.9,-11; 10 13.86,-11; 11 17.82,-11; 12 21.78,-11; 13 -21.78,11; 14 -17.82,11; 15 -13.86,11; 16 -9.9,11; 17 -5.94,11; 18 -1.98,11; 19 1.98,11; 20 5.94,11; 21 9.9,11; 22 13.86,11; 23 17.82,11; 24 21.78,11
22-23-2051 = drill 1 pad 1.676: 1 -5.08,0; 2 -2.54,0; 3 0,0; 4 2.54,0; 5 5.08,0

### Placement (x,y rotation side)
1  74.42,25 270 top
2  63.63,25 270 top
C1  26.16,45 90 bottom
C2  48.07,23.09 90 bottom
C3  44.51,23.09 90 bottom
C4  60.58,9.18 270 bottom
C5  41.4,2.33 0 bottom
C6  28.45,58.08 0 bottom  (outside the outline)
C7  6.6,59.73 180 bottom  (outside the outline)
C8  26.67,4.36 90 bottom
C9  41.15,23.03 0 bottom
D1  19.68,15.79 0 bottom
D2  19.68,11.72 0 bottom
D3  27.3,39.54 0 bottom
D8  1N4007  [DO-214AC']  51.94,22.65 90 bottom
D10  53.98,36.36 180 bottom
D11  53.98,40.68 180 bottom
D12  19.68,7.66 0 bottom
D13  19.68,3.6 0 bottom
D14  53.98,32.55 180 bottom
D15  19.68,19.85 0 bottom
IC1  55.88,4.87 270 top
IC2  51.69,3.6 270 bottom
IC3  84.58,41.95 270 bottom
IC4  44.58,45.25 0 top
IC5  20.7,44.24 180 bottom
IC6  84.58,23.92 270 bottom
IC7  43.94,10.2 270 bottom
IC8  20.57,60.75 0 bottom  (outside the outline)
IC9  1.52,61 0 bottom  (outside the outline)
J1  62.87,48.94 0 top
JP1  7.24,31.41 180 top
JP2  17.53,52.36 180 top
LED1  56.13,9.25 0 top
LED2  56.13,12.75 0 top
LED3  56.13,16.25 0 top
LED4  56.13,19.75 0 top
LED5  56.13,23.25 0 top
LED6  56.13,26.75 0 top
LED7  56.13,30.25 0 top
LED8  56.13,44.24 0 top
Q1  [SOT89']  20.57,33.57 270 bottom
Q2  [SOT89']  44.7,29.5 90 bottom
Q3  22.22,33.57 270 bottom
Q4  42.93,29.5 90 bottom
Q5  84.07,15.03 180 top
Q6  84.07,26.71 0 top
Q7  [SOT89']  80.26,2.83 90 bottom
Q8  [SOT89']  67.31,2.58 90 bottom
Q9  MY  [SOT89']  27.43,16.93 0 bottom
Q10  43.56,43.85 90 bottom
R1  26.67,7.66 90 bottom
R2  38.23,8.1 180 bottom
R3  38.23,14.26 0 bottom
R4  62.1,23.79 270 bottom
R5  27.94,24.17 90 bottom
R6  46.61,2.33 0 bottom
R7  47.88,46.4 90 bottom
R8  38.73,2.33 180 bottom
R9  38.61,23.03 0 bottom
R10  47.56,18.96 270 bottom
R11  52.58,7.66 0 bottom
R12  42.61,18.96 270 bottom
R13  28.45,42.46 90 bottom
R14  43.56,47.16 90 bottom
R15  49.91,10.96 180 bottom
R16  52.58,12.3 180 bottom
R17  52.58,16.87 0 bottom
R18  43.31,38.27 180 bottom
R19  46.16,16.74 270 bottom
R20  76.71,12.74 180 bottom
R21  72.9,8.42 180 bottom
R22  66.29,19.6 90 bottom
R23  46.35,41.31 0 bottom
R24  26.16,47.79 270 bottom
R25  44.07,2.33 0 bottom
R26  18.03,38.65 270 bottom
R27  1.27,17.12 90 top
R28  1.27,37.7 90 top
R29  5.59,40.93 90 bottom
R30  5.59,37.89 90 bottom
R31  5.59,34.84 90 bottom
R32  21.84,24.17 270 bottom
R33  29.46,35.47 0 bottom
R36  5.59,17.12 90 top
R37  5.59,37.7 270 top
R38  87.25,7.53 270 bottom
R39  R_user  [R0805']  86.74,8.29 270 top
R40  28.32,63.41 180 bottom  (outside the outline)
RPM  52.96,48.81 0 bottom
T1  84.33,14.14 90 bottom
T3  27.43,11.72 0 bottom
TACHO_BEL  30.48,3.34 0 bottom
TP1  69.34,5.76 0 bottom
TP2  78.23,6.39 0 bottom
TP3  72.2,10.84 0 bottom
TP4  74.74,16.23 0 bottom
TP5  72.2,21.63 0 bottom
TP6  74.74,23.22 0 bottom
TP7  71.88,28.93 0 bottom
TP8  74.74,30.2 0 bottom
TP9  69.34,34.01 0 bottom
TP10  74.74,36.55 0 bottom
TP11  69.02,41 0 bottom
TP12  63.94,5.76 0 bottom
TP16  63.94,9.25 0 bottom
TP17  63.94,12.74 0 bottom
TP18  69.66,16.23 0 bottom
TP19  58.55,18.77 0 bottom
TP21  69.34,23.22 0 bottom
TP22  63.94,26.71 0 bottom
TP23  63.94,30.84 0 bottom
TP24  58.86,32.74 0 bottom
TP25  69.28,36.68 0 bottom
TP26  69.6,31.28 0 bottom
U$1  [CE_10.00]  17.78,1.56 0 top
X1  23.05,25 270 top
X2  82.68,7.66 90 top
X3  72.83,48.94 180 top

### Tracks (layer width: path | path; a pad name or v marks a point on that pad's centre or on a via)
+10V  (6 unrouted)
  Bottom 0.406: R40.2 25.15,64.3 25.02,64.43 | 25.02,61.89 22.48,59.35 IC8.3
+12V  (via drill 0.6)  (3 unrouted)
  Top 0.406: IC1.IN 56.13,3.34 | 60.96,5.5 60.93,5.5 | v22.61,45 19.05,45 v18.29,44.11
  Top 0.61: 69.47,19.6 69.47,20.36 71.25,22.65 71.25,24.3 v68.2,26.33 70.48,28.49 73.15,32.04 75.69,32.17 81.28,33.57 83.06,34.08 83.06,45.78 v81.41,48.17 | 69.47,19.6 69.47,18.96 69.72,16.93 69.72,15.15 69.09,13.76 68.83,9.95 69.72,9.06 v69.72,8.42 69.6,8.42 67.31,6.14 61.56,6.14 2.1 | 56.13,3.34 58.93,3.34 60.96,5.5 | v37.46,28.87 41.27,28.87 | v68.58,19.6 69.47,19.6 | v15.49,40.86 15.49,41.06 v18.29,44.11
  Top 0.711: 36.39,28.97 31.18,28.97
  Top 0.813: v81.41,48.17 X3.1
  Top 1.016: v49.15,28.87 v37.46,28.87 36.39,28.97 | 31.18,28.97 v29.65,28.93
  Top 1.422: v29.65,28.93 v28.13,28.93
  Bottom 0.406: IC3.16 81.41,46.4 v81.41,48.17 | R20.1 73.66,9.95 72.64,9.44 R21.1 | v37.46,28.87 37.85,29 37.85,31.03 38.58,31.81 Q4.3 40.89,31.81 Q2.3 | IC2.3 54.89,2.35 55.63,2.83 IC1.IN | Q1.3 23.49,31.26 Q3.3 | v18.29,44.11 18.29,43.47 18.8,42.97 | R31.2 2.16,34.33 | 2.29,37.38 2.29,37.12 | 2.29,37.12 2.29,36.87 | R30.2 2.54,37.63 2.29,37.12 | R29.2 2.16,40.93
  Bottom 0.61: 2.1 TP12.TP 64.33,6.14 | 64.77,28.87 54.36,28.87 | R21.1 v69.72,8.42 | R32.1 20.83,26.96 20.57,27.22 | R22.1 v68.58,19.6 | 2.29,36.87 2.29,39.41 7.11,39.41 8.89,40.86 v15.49,40.86
  Bottom 0.711: 64.77,28.87 67.56,26.33 | 54.36,28.87 53.59,27.85
  Bottom 0.813: 67.56,26.33 v68.2,26.33 | 53.59,27.85 50.16,27.85 v49.15,28.87
  Bottom 1.016: R28.2 2.16,41.19 2.16,40.93 2.16,34.33 2.16,31.03 3.56,28.87 3.56,23.54 7.37,23.54 8.4,25.57 X1.6 12.47,27.22 20.57,27.22 25.91,27.22 27.37,28.93 v28.13,28.93 27.61,29.45 Q3.3
GND  (via drill 0.6, 1 pad 1.78)  (7 unrouted)
  Top 0.61: X2.1 86.49,6.39 R39.2
  Top 1.27: v46.23,26.07 40.13,26.84 35.43,26.84
  Bottom 1.27: 29.34,27.03 37.27,27.03
  other vias: -2.92,40.05 19.43,25.57 67.44,12.61 76.07,33.95 64.14,21.25 24.38,2.33 51.05,8.42 49.78,25.69 58.42,10.96 88.77,17.95 89.03,35.47 16,13.5 56.13,25.69 21.72,28.87 25.27,29.12 70.23,10.58 49.15,1.18 43.43,7.66 62.36,1.18 76.71,27.73 48.89,14.64 14.61,49.19 64.14,24.8 2.41,21 61.09,31.16 49.91,44.87 -3.43,42.84 28.83,47.92 28.83,31.16 30.86,41.31
  pour Bottom: 0,50.08 90.3,50.08 90.42,6.9 89.92,5.88 80.52,5.88 77.34,5.5 77.34,0.17 0,-0.09
  pour Top: 0,50.08 90.3,50.08 90.3,-0.09 0,-0.09
N$1  (via drill 0.6)  (2 unrouted)
  Top 0.406: v53.72,31.79 53.72,31.41 53.09,30.77 50.55,30.77 | v2.79,2.33 1.02,2.33 1.02,4.87 v2.79,4.87
  Top 0.61: v24.64,20.36 27.43,20.36 30.23,24.04 30.86,25.01 38.1,25.01 40.77,23.28 47.62,23.28 48.64,26.46 50.55,27.73
  Top 0.813: 50.55,27.73 50.55,30.77 52.83,33.19 58.87,33.19 59.87,33.75 2.9
  Bottom 0.406: v53.72,31.79 52.2,32.28 51.73,32.28 D14.1
  Bottom 0.61: v24.64,20.36 23.88,20.36 23.88,14.77 21.84,11.72 21.84,9.69 | D13.1 21.73,3.71 19.81,5.63 16,5.63 15.49,5.2 8.64,5.2 6.35,3.6 v2.79,2.33 | v2.79,4.87 5.59,4.87 9.14,9.18 15.49,9.18 16,9.69 21.84,9.69 | 21.84,9.69 21.84,7.66 D12.1
  Bottom 1.016: 59.18,32.74 60.31,32.92 60.35,32.92 2.9
N$2  (via drill 0.6)
  Top 0.406: 30.67,44.82 36.7,44.82 37.72,45.89 39.37,45.89 43.75,43.09 52.83,43.09 53.85,42.97 58.04,42.97 58.93,43.35 63.12,43.35 66.04,41.76
  Top 0.61: X1.4 12.26,34.97 16.51,34.97 28.07,44.06 30.67,44.82 | 66.04,41.76 70.68,38.97 72.9,38.97 v75.38,39.41 75.44,39.35 78.99,39.35 80.65,40.24 80.65,45.51 79.18,46.71 76.01,46.71 75.38,47.35 X3.2
  Bottom 0.406: v75.38,39.41 78.87,39.41 80.14,38.77 IC3.10 | R31.1 8.64,34.84
  Bottom 0.61: 8.64,34.84 11.98,34.84 X1.4
N$3  (via drill 0.6)  (2 unrouted)
  Top 0.406: 29.65,46.52 31.43,48.53 46.29,48.53 51.37,46.22 68.9,46.22 70.17,45.38 72.9,43.09 74.04,43.09 75.28,42.21 | v78.23,42.27 77.91,41.95 76.33,41.95 75.28,42.21 | 73.15,46.4 74.74,44.81 74.74,42.75 75.28,42.21
  Top 0.61: X1.3 12.43,39.09 17.97,39.09 27.43,46.52 29.65,46.52 | X3.3 72.83,46.71 73.15,46.4
  Bottom 0.406: IC3.13 79.18,42.59 78.55,42.27 v78.23,42.27 | 8.64,38.9 7.62,38.14 6.6,37.89
  Bottom 0.61: X1.3 8.68,38.86
N$4  (1 unrouted)
  Top 0.406: 30.29,21 36.32,21
  Top 0.61: X1.8 28.35,19.06 30.29,21 | 36.32,21 50.29,21 53.47,24.8 54.74,26.58 54.93,26.65
  Bottom 0.406: 2.7 59.18,27.98 55.88,27.98 54.9,26.75
  Bottom 0.61: TP22.TP 61.22,26.71 2.7 | 54.9,26.75 LED6.A
N$5  (via drill 0.6)  (2 unrouted)
  Top 0.61: Q5.3 81.76,15 77.72,10.96 76.09,10.96 75.01,9.88 75.01,8.34 v76.45,7.41
  Bottom 0.406: Q8.3 66.29,4.36 73.64,4.36 74.17,5.37 74.17,7.91
  Bottom 0.61: T1.1 79.88,11.85 78.99,10.96 75.69,10.96 74.17,8.93 | v76.45,7.41 74.42,8.17 R21.2
N$6  (via drill 0.6)
  Top 0.406: 42.67,42.2 62.74,42.2
  Top 0.61: v38.1,44.8 41.66,42.71 42.67,42.2 | v81.15,35.35 74.3,35.35 62.74,42.2
  Bottom 0.406: v81.15,35.35 81.15,29.73 IC6.16
  Bottom 0.61: v38.1,44.8 29.84,44.8 29.34,44.11 R13.1
N$7
  Bottom 0.406: R2.2 41.34,8.99 IC7.10
N$8
  Bottom 1.27: R27.2 R28.1
N$9  (via drill 0.6)  (1 unrouted)
  Top 0.406: v72.64,14.77 73.41,14.77 75.44,14.01 75.44,11.98 73.91,10.2 73.91,7.66 76.71,5.63 v76.71,4.87
  Top 0.61: Q6.3 86.39,24.91 84.96,25.95 80.65,25.95 80.01,24.42 80.01,18.07 75.44,18.07 74.42,16.55 v72.64,14.77
  Bottom 0.406: v76.71,4.87 77.22,4.36 Q7.3
  Bottom 0.61: T1.3 79.88,14.9 77.98,12.99 77.98,14.01 77.72,14.26 73.15,14.26 v72.64,14.77
N$10  (1 unrouted)
  Bottom 0.61: 87.38,17.57 87.38,15.03
  Bottom 3.175: 84.33,17.06 84.33,14.52
N$11  (via drill 0.6)  (1 unrouted)
  Top 0.813: v17.27,25.19 17.27,29.16 15.49,30.94 X1.5
  Bottom 0.406: Q3.2 19.3,33.57
  Bottom 0.813: D15.2 17.27,19.6 v17.27,25.19
  Bottom 1.016: 19.3,33.57 19.3,30.94 16.76,30.94
  Bottom 2.54: X1.5 16.76,30.94
N$12  (1 unrouted)
  Top 0.711: 21.08,5.2 36.45,5.2
  Top 0.813: X1.12 12.2,3.21 16,3.21 21.08,5.2 | 36.45,5.2 47.75,5.2 49.4,5.12 51.05,5.12 53.72,7.66 56.77,7.66 LED1.K 2.2
  Bottom 0.61: TP16.TP 2.2 | 12.7,3.21 17.25,3.21 17.25,3.41 D13.2
N$13  (1 unrouted)
  Top 0.406: 57.36,13.93 56.9,14.11 53.34,14.11 52.07,15.79
  Top 0.61: 57.36,12.74 57.36,13.93 | 52.07,15.79 44.89,15.79 36.91,9.17
  Top 0.711: 36.91,9.17 24.52,9.17
  Top 0.813: 2.3 57.36,12.74 | 24.52,9.17 15.85,7.18 X1.11
  Bottom 0.61: TP17.TP 2.3 | X1.11 17.28,7.18 17.28,7.16 17.27,7.15 17.27,7.49 D12.2
N$14  (1 unrouted)
  Top 0.406: 52.45,16.8 53.85,14.92 57.02,14.92 57.34,16.23
  Top 0.61: 38.23,13.11 43.94,16.8 52.45,16.8
  Top 0.711: 30.92,13.11 38.23,13.11
  Top 0.813: X1.10 12.21,11.15 29.65,11.15 30.92,13.11 | 57.34,16.23 64.6,16.25 2.4
  Bottom 0.61: TP18.TP 66.69,16.23 2.4 | X1.10 12.69,11.14 12.7,11.15 17.06,11.15 17.06,11.35 D2.2
N$15
  Bottom 0.61: IC4.3 47.12,39.16 46.35,39.92 46.35,41.31 | 46.35,41.31 46.35,42.46 47.62,43.6 52.2,43.6 54.23,45.63 56.01,45.63 LED8.K | R23.2 46.35,41.31
N$16  (via drill 0.6)
  Top 0.406: v40.39,19.34 v37.72,19.34
  Bottom 0.406: 44.93,7.66 44.93,6.39 IC7.8 | 44.93,7.66 IC7.6 | 44.93,7.66 44.93,8.7 43.43,10.2 43.41,14.77 41.4,17.44 41.27,17.57 40.64,17.69 v40.39,19.34 | v37.72,19.34 37.59,19.47 37.42,20.29 36.73,21 30.73,21 29.34,22.52 R5.1
N$17  (via drill 0.6)
  Top 0.406: 25.27,49.06 26.04,49.29 46.93,49.29 51.94,46.97 69.98,46.97 v73.47,44.17
  Top 0.61: X1.2 12.28,42.9 14.35,43.16 15.37,43.85 18.03,46.52 24.77,48.81 25.27,49.06 | X3.4 69.98,48.94 69.98,46.97
  Bottom 0.406: IC3.12 79.18,41.31 78.55,41 76.96,41 74.1,42.59 v73.47,44.17 | R29.1 7.11,41.44 8.38,42.71
  Bottom 0.61: 8.38,42.71 11.94,42.71 X1.2
N$18
  Bottom 0.406: IC3.15 83.31,45.12 84.2,44.11 84.2,34.84 84.96,34.08 84.96,24.8 86.11,23.28 IC6.5
N$19
  Top 0.61: 57.78,41.06 59.75,38.77 60.77,38.77 61.4,38.14 61.91,37.76 64.71,34.9 64.71,31.54 | 65.68,30.52 2.8
  Top 0.813: X1.14 37.99,42.82 39.75,41.06 57.78,41.06 | 64.71,31.54 65.68,30.52
  Bottom 0.406: 63.8,30.69 63.71,29.88 57.59,29.88 57.59,30.06 LED7.K | 56.77,31.94 56.22,32.19 D14.2
  Bottom 0.61: LED7.K 56.77,31.94
  Bottom 1.016: 2.8 TP23.TP 63.8,30.69
N$20  (via drill 0.81)  (1 unrouted)
  Top 0.813: X1.17 36.16,30.81 36.96,30.27 48.39,30.27 48.51,30.77 52.32,34.71 v53.34,35.09
  Bottom 0.813: 58.8,34.71 58.17,34.33 54.36,34.33 v53.34,35.09 51.69,36.34
  Bottom 1.016: 1.9 69.6,33.75 TP9.TP 65.35,34.19 63.63,35.6 59.69,35.6 58.8,34.71
N$21  (via drill 0.6)
  Top 0.61: X1.19 37.39,23.02 39.88,22.14 49.34,22.14 52.77,26.07 v52.77,29.31
  Bottom 0.61: 63.18,42.33 54.7,42.33 53.34,40.68 | 53.34,40.68 53.34,38.01 49.78,38.01 49.78,31.16 51.24,29.31 v52.77,29.31 | D11.1 53.34,40.68
  Bottom 1.016: 63.18,42.33 64.58,41 TP11.TP 69.34,40.68 71.21,40.68 1.11
N$23
  Bottom 0.406: R1.2 25.91,8.68 26.54,9.31 29.46,9.31 31.37,10.96
  Bottom 0.61: 31.37,10.96 33.9,10.96 X1.22
N$24  (1 unrouted)
  Bottom 0.406: IC7.11 37.21,10.2 36.32,9.18 30.99,9.18 28.96,7.66 R1.1 C8.1
N$25
  Bottom 0.406: IC6.13 78.36,24.55
  Bottom 0.61: TP6.TP 77.44,23.22 1.6 78.36,24.55
N$26
  Bottom 0.406: 75.19,26.75 1.7 | IC6.14 76.93,25.82
  Bottom 0.61: TP7.TP 71.88,26.84 1.7 | 76.93,25.82 75.19,26.75
N$27  (via drill 0.6)  (1 unrouted)
  Top 0.406: 67.44,33.44 66.55,34.33 63.88,37.12 63.37,38.39 | 57.34,18.14 56.52,17.59 53.85,17.59 53.47,17.69 | v38.23,16.3 39,16.55 38.98,16.56
  Top 0.508: 67.44,33.44 68.2,32.3 | 63.12,18.14 57.34,18.14 | 53.47,17.69 43.69,17.69 38.98,16.56
  Top 0.61: 63.12,18.14 65.15,19.28 68.33,21.12 69.22,22.01 69.22,24.17 66.68,25.82 66.68,27.34 68.71,28.36 69.34,29.38 69.34,31.16 68.2,32.3 v66.29,32.42 | 2.11 61.18,40.59 63.37,38.39
  Bottom 0.406: TP26.TP 69.34,31.66 67.82,32.17 | R3.1 v38.23,16.3
  Bottom 0.61: 67.76,32.17 v66.29,32.42
N$28
  Bottom 0.406: R14.1 45.34,47.92 49.4,47.92 50.04,47.28 | J1.1 61.6,48.68 60.96,47.79 58.93,47.28 50.04,47.28 | R7.1 49.15,46.4 50.04,47.28
  Bottom 0.61: J1.1 64.14,46.79 2.12
N$29  (via drill 0.6)
  Top 0.61: v47.37,31.66 48.77,32.93 48.77,36.87 48.51,37.12 v48.51,37.76
  Bottom 0.406: Q4.2 Q2.2 46.48,29.5
  Bottom 0.61: 46.48,29.5 46.48,30.52 v47.37,31.66 | v48.51,37.76 48.51,39.16 48.77,39.41 48.77,41.44 | 48.77,41.44 49.78,42.46 52.96,42.46 54.74,44.24 LED8.A | R23.1 47.75,41.44 48.77,41.44
N$30
  Bottom 0.406: R25.2 C5.1 40.13,3.21 | IC7.9 40.01,7.53 39.5,6.9 39.5,4.74 40.13,4.1 40.13,3.21 | 40.13,3.21 R8.2
N$31
  Bottom 0.406: R9.2 38.73,21.38 | 38.73,21.38 38.73,17.31 40.51,15.53 40.51,14.08 IC7.14 | 38.73,21.38 39.88,21.38 C9.2
N$32
  Bottom 0.406: D3.2 25.06,43.73 | 25.06,43.73 25.06,44.79 C1.2 R24.1 | IC5.2 20.07,45.51 20.57,45 20.83,45 22.1,43.73 | 22.1,43.73 25.06,43.73 | 22.1,43.73 21.34,42.97 IC5.6
N$34
  Bottom 0.61: LED6.K 59.03,25.35 R4.1
N$35  (via drill 0.6)
  Top 0.711: 38.61,32.91 31.05,32.91
  Top 0.813: 38.61,32.91 40.13,32.93 IC4.1
  Top 1.016: 31.05,32.91 28.8,32.91 23.37,30.77 23.37,25.19 22.35,24.17 | 22.35,24.17 20.99,22.92 12.29,22.92 X1.7 | 22.35,24.17 v25.65,24.17
  Bottom 0.61: v25.65,24.17 25.53,24.3 R5.2 | R18.1 42.01,36.77 IC4.1
N$36
  Bottom 0.406: R9.1 39.62,25.44 39.62,26.99 Q4.1 41.91,27.19 Q2.1
N$37  (via drill 0.6)
  Top 0.406: 85.34,46.52 85.85,46.01 85.85,35.09 85.6,34.84 85.6,32.04 87.88,31.03 87.88,21.63 86.49,21.25 v85.34,21.25
  Top 0.61: v84.84,47.03 85.34,46.52
  Bottom 0.406: IC3.2 86.17,45.12 v84.84,47.03 | IC6.7 85.6,20.74 v85.34,21.25
N$38
  Bottom 0.406: 1.3 72.01,12.75 71.5,13.51 71.5,17.31 74.42,18.45 74.8,18.45 75.95,19.6 78.11,19.6 80.26,22.01 IC6.11
  Bottom 0.61: TP3.TP 72.2,12.52 1.3
N$39
  Bottom 0.406: 1.5 74.57,19.75 75.69,20.87 77.98,20.87 79.25,22.14 79.88,22.9 80.26,23.28 IC6.12
  Bottom 0.61: 1.5 71.97,21.4 TP5.TP
N$41
  Top 0.508: 58.8,25.57 58.8,27.6
  Top 0.61: LED1.A LED2.A | LED4.A LED5.A 56.77,24.68 58.29,25.19 58.8,25.57 | 58.8,27.6 57.91,28.74 56.37,28.74 LED7.A
  Bottom 0.61: LED1.A 54.86,8.93 54.36,8.42 52.77,8.42 R11.1 | LED2.A LED3.A LED4.A
N$42
  Bottom 0.406: X1.16 31.05,34.9 30.73,34.58 R33.2
N$43
  Bottom 0.406: Q1.1 23.52,35.88 Q3.1
  Bottom 0.61: Q3.1 27.56,37.71 R13.2
N$44
  Bottom 0.406: IC6.2 IC6.1 88.01,29.02 88.01,33.06 85.09,36.11 85.09,42.97 85.98,43.85 IC3.3
N$45
  Bottom 0.406: C2.1 46.79,20.08 R10.1 R12.2
N$46  (1 unrouted)
  Bottom 0.406: 46.46,10.2 44.7,10.2 44.2,10.96 44.2,15.28 42.42,17.82 R12.1 42.42,20.39 C3.1
N$47
  Bottom 0.406: R17.2 R16.2 51.82,12.87 51.31,12.36 51.31,10.71 R15.1 49.4,8.93 IC7.5
N$48
  Bottom 0.406: Q10.3 45.72,43.85 R7.2
N$49
  Bottom 0.406: R17.1 52.2,17.82 52.2,20.03 D8.1
N$50  (via drill 0.6)
  Top 0.406: v86.87,32.68 86.67,32.68 86.73,32.73
  Top 0.61: 86.73,32.73 86.74,33.63 86.74,47.79 v87.12,48.3
  Bottom 0.406: IC6.4 86.3,24.55 85.85,25.19 85.85,31.09 v86.87,32.68
  Bottom 0.61: v87.12,48.3 87.12,46.4 IC3.1
N$52
  Bottom 0.406: 77.52,30.2 1.8 78.35,27.09 IC6.15
  Bottom 0.61: TP8.TP 77.43,30.2 1.8
N$53  (via drill 0.6)
  Top 0.813: X1.15 38.48,39.85 57.15,39.85 59.18,37.38 59.31,37.19 v59.82,37.19
  Bottom 0.61: TP25.TP 66.62,37.19
  Bottom 0.813: v59.82,37.19 66.62,37.19 2.10
N$54
  Bottom 0.61: 21.73,16.66 21.73,15.98 D1.1
  Bottom 0.711: 15.24,17.06 7.81,17.06
  Bottom 1.016: 21.73,16.66 20.57,17.82 16,17.82 15.24,17.06
  Bottom 1.27: 7.81,17.06 4.06,14.52 R27.1
N$55
  Top 0.406: LED4.K 56.2,18.43 53.98,18.43 53.59,18.71 | 36.48,17.03 30.45,17.03 30.23,17.06
  Top 0.61: 2.5 LED4.K | 53.59,18.71 43.33,18.71 40.13,17.95 38.35,17.95 36.67,17.03 36.48,17.03 | X1.9 12.33,14.96 16,14.96 21.59,17.82 28.45,17.82 29.21,17.06 30.23,17.06
  Bottom 0.61: TP19.TP 58.55,18.86 59.44,19.75 2.5 | X1.9 17.07,15.1 17.07,15.42 D1.2
N$56  (1 unrouted)
  Bottom 0.406: IC3.14 82.68,43.85 83.31,43.22 83.31,34.33 84.07,33.44 84.07,24.3 85.98,22.01 87.76,22.01
N$57  (via drill 0.6)  (3 unrouted)
  Top 0.406: Q6.2 84.07,21.12 84.58,20.11 85.85,19.67 Q5.1
  Top 0.61: X2.2 v84.9,9.25 86.49,9.25 | Q6.1 Q6.2 | Q5.1 86.39,15.94 T1.6 87.43,10.76 86.87,10.2 86.87,9.37 R39.1
  Bottom 0.406: v84.9,9.25 89.15,9.25 89.15,14.77 88.77,14.9 | Q8.1 66.29,0.55 76.51,0.55 Q7.1 | 81.79,8.93 X2.2
  Bottom 0.61: T1.2 83.57,13.38 85.09,14.9 | T1.4 83.77,16.42 83.82,16.42 | X2.2 84.58,8.93 | 84.58,8.93 v84.9,9.25 | 84.58,8.93 86.43,8.93 R38.1 | 85.09,14.9 T1.6 88.77,14.9 | 85.09,14.9 83.82,16.42 | 80.52,7.41 81.79,8.93 | Q7.1 78.08,2.58 Q7.2 | 80.52,2.83 85.09,2.83 | 81.28,1.06 81.28,3.09 | 82.04,2.58 82.04,4.61 | 81.15,16.5 81.15,17.82 | 83.82,16.42 87.38,16.42
  Bottom 0.813: 80.52,2.83 80.52,7.41
  Bottom 1.27: 80.47,17.95 87.12,17.95
  pour Bottom: 76.96,5.12 88.39,5.12 88.39,0.04 76.96,0.04
N$58
  Top 0.61: X1.24 30.87,3.22 TACHO_BEL.TP
N$59  (1 unrouted)
  Top 0.61: Q5.2 84.07,12.49 82.09,12.49 79,9.39 77.61,9.39 1.2
  Bottom 0.406: Q8.2 73.91,2.58 75.44,6.14 77.98,6.14 TP2.TP
  Bottom 0.61: TP2.TP 78.11,8.42 78.11,9.05 1.2 79.5,9.44 81.28,10.45 83.06,10.45 84.33,11.72 87.63,11.72 87.5,11.85 | T1.8 87.5,11.85 | 87.5,13.25 87.5,11.85 | 86.11,13.12 87,13.38 | 69.34,1.69 70.74,1.69 | 69.34,3.47 70.74,3.47
  pour Bottom: 66.55,3.85 73.41,3.85 74.68,5.12 75.18,14.52 88.9,14.52 88.9,9.44 81.28,9.44 77.22,5.37 77.22,5.12 76.71,4.61 76.71,0.8 66.55,0.8
N$60  (1 unrouted)
  Top 0.61: 2.6 LED5.K
  Bottom 0.406: IC7.2 47.75,12.74 49.4,13.63 49.78,14.01 51.05,14.01 51.05,18.45 50.29,19.47 50.29,22.39 51.13,23.48 D8.2 | 57.4,22.39 56.9,21.88 53.8,21.88 D8.2 | D8.2 51.94,25.31 50.55,26.71 49.78,26.71 48.13,28.23 48.13,29.25 48.89,30.14 48.89,32.81 41.91,32.81 40.39,33.06 40.39,40.05 42.67,42.97
  Bottom 0.61: TP21.TP 66.71,23.22 | 66.71,23.22 2.6 | LED5.K 57.4,22.39 | 66.71,23.22 66.71,22.81 65.28,21.38 65.28,19.73 R22.2
N$61  (1 unrouted)
  Bottom 0.305: 87.63,25.82 89.28,25.82 89.28,29.25 88.9,29.76
  Bottom 0.406: 88.9,29.76 88.9,33.57 85.93,36.55 85.93,40.05 IC3.6
N$63
  Bottom 1.422: 28.07,28.87 29.59,28.87
N$64
  Bottom 0.61: IC4.2 R18.2
N$65
  Bottom 0.406: IC5.5 22.61,40.68 21.84,39.66 19.94,39.66 R26.2
N$67
  Bottom 0.406: IC6.10 80.26,20.74 79.25,19.47 79.25,18.03 1.4
  Bottom 0.61: TP4.TP 77.46,16.23 1.4
N$69
  Top 0.813: 40.77,2.01 45.21,2.07 46.23,3.09 50.55,3.09 51.75,1.88 59.69,1.88
  Top 1.016: X1.1 9.91,46.71 7.94,45.12 7.94,36.68 3.3,32.04 3.3,24.68 7.87,20.11 7.94,2.01 9.91,0.93 37.78,0.93 40.77,2.01 | 59.69,1.88 61.91,3.53 66.57,3.53 1.1
  Bottom 0.61: TP1.TP 1.1
N$70
  Top 0.813: 69.09,26.71 69.09,26.2
N$83
  Bottom 0.406: 45.47,3.34 45.47,4.74 IC7.7 | 44.39,3.53 R25.1 44.2,3.34 45.47,3.34 | 45.47,3.34 46.48,3.34 R6.1
N$84  (via drill 0.6)
  Top 0.61: X1.21 26.09,15.1 v25.53,16.55
  Bottom 0.406: 38.73,13.12 R3.2 37.72,13.38 36.07,15.03 34.12,15.03 X1.21 | Q9.2 T3.C
  Bottom 0.61: v25.53,16.55 27.43,16.55 Q9.2
N$85  (1 unrouted)
  Bottom 0.406: IC7.13 39.88,12.74 39.12,11.98 37.34,11.98 36.58,13.12 29.03,13.12 | R32.2 25.02,22.77 27.94,21.12 29.46,18.84 29.46,15.28 Q9.1 28.96,14.06 28.96,12.47 T3.B
N$86  (1 unrouted)
  Bottom 0.406: R26.1 17.14,48.17 17.53,48.81 21.34,48.81 IC5.3
  Bottom 0.61: RPM.TP 50.8,48.81 50.29,49.32 21.84,49.32 21.34,48.81
N$87
  Bottom 0.406: R33.1 29.46,39.71 D3.1
N$90  (1 unrouted)
  Bottom 0.406: IC8.5 19.94,59.35 19.56,59.73 17.78,59.73 17.4,59.35 IC8.7
N$91  (via drill 1 pad 1.93)
  other vias: 53.59,48.81
N$92
  Bottom 0.406: IC8.2 23.75,58.84 24.64,59.73 27.18,59.73 28.19,60.75 | 28.19,60.75 28.19,62.4 R40.1 | C6.1 28.45,60.49 28.19,60.75
N$93  (via drill 0.6)
  Top 0.711: 40.13,36.87 23.88,36.87 | 20.07,32.91 9.14,32.91
  Top 0.813: v56.13,38.65 41.91,38.65 40.13,36.87 | 23.88,36.87 20.07,32.91 | 9.14,32.91 7.72,32.91 JP1.1
  Bottom 0.813: D11.2 56.17,38.52 D10.2 56.13,36.36 v56.13,38.65
  Bottom 1.016: 1.10 TP10.TP 72.39,36.62 71,38.01 69.02,39.09 64.26,39.09 63.94,38.77 58.17,38.77 57.66,38.52
  Bottom 1.93: 57.66,38.52 56.17,38.52
N$94
  Top 0.813: R37.2 5.59,27.47 | 5.59,27.47 R36.2 | JP1.2 7.24,27.85 6.86,27.47 5.59,27.47
N$580  (1 unrouted)
  Bottom 0.406: 46.1,14.01 47.12,15.03 47.12,16.23 R19.2 48.38,17.95 R10.2
VCC  (via drill 0.6)
  Top 0.61: v49.91,7.03 49.91,12.61 v50.29,13.12
  Bottom 0.406: R19.1 45.15,16.23 44.98,15.15 44.98,11.47 IC7.3 48.77,11.47 49.28,11.98 49.34,11.98 R15.2 | R6.2 48.01,2.33 48.01,5.5 48.89,5.5 49.15,5.75 49.15,6.26 | IC2.1 53.44,5.6 54.48,6.14
  Bottom 0.61: v50.29,13.12 R15.2 | 54.48,6.9 52.58,6.9 | 52.58,6.9 51.05,6.9 | C4.1 56.64,6.14 | R11.2 52.58,6.9
  Bottom 0.813: 54.48,6.9 54.48,6.14 IC1.OUT 56.64,6.14 | 51.05,6.9 49.78,6.9 | 49.78,6.9 v49.91,7.03 | 49.15,6.26 49.78,6.9

### Text on the board
Top: top | BEP V2.2 / maru-labs.com
tPlace: QC
bPlace: 4 | 3 | 2 | 1 | b | c | 5 | a | 5 | 4 | 3 | 1 | 2
tNames: RPM | GND c b a 12V(rt) | GND / BT / HiB | EMU / REV / HiB | RPM | 18 | 19 < | 2.7 / 2.6 | Bulb Test / cut here | 1.12 GND / 1.11 < / 1.10 <> / 1.9 > / 1.8 N / 1.7 G5 / G4 / 1.5 G3 / 1.4 G2 / 1.3 G1 | 1.2 CC | WL / BT / ABS / FUL / ALT / TMP / OIL / CHK / IGN | 1.1 STBY | 1ST BY / 2 GC / 3 GB / 4 GA / 5 START / 6ZP + / 7 FUL / 8 ABS / 9 ALT / 10 TMP / OIL / CHK | 2.12 / 2.11 / 2.1 / 2.9 / / / / 2.5 / 2.4 / 2.3 / 2.2 / 2.1 | Choke / cut here | 13 / 14 / 15 / 16 / 17 > / / / / 21 Rev in / 22 REV out / 23 / 24
bNames: N | N | GND / < / <> / > / N / G5 / G4 / G3 / G2 / G1 / CC / / STBY
bValues: BA | BA / RH | 6,8 | 2.4V(off)/1.1V(on) | 4 | 6V | 13 GND / 14 BT / 15 HiB / 16 RPM / 17 > / 18 GND / 19 < / / 21 Rev in / 22 REV o / 23 GND | EMU / REV / HiB / WL / BT / ABS / FUL / ALT / TMP / OIL / CHK / IGN | 4.7V | BA | BA | 1 STBY / 2 GC / 3 GB / 4 GA / 5 START / 6 ZP+ / 7 FUL / 8 ABS / 9 ALT / 10 TMP / 11 OIL / 12 CHK
tStop: BEP V2.2 / maru-labs.com
tDocu: +12v